# Altium schematic sheet top.SchDoc
size A4
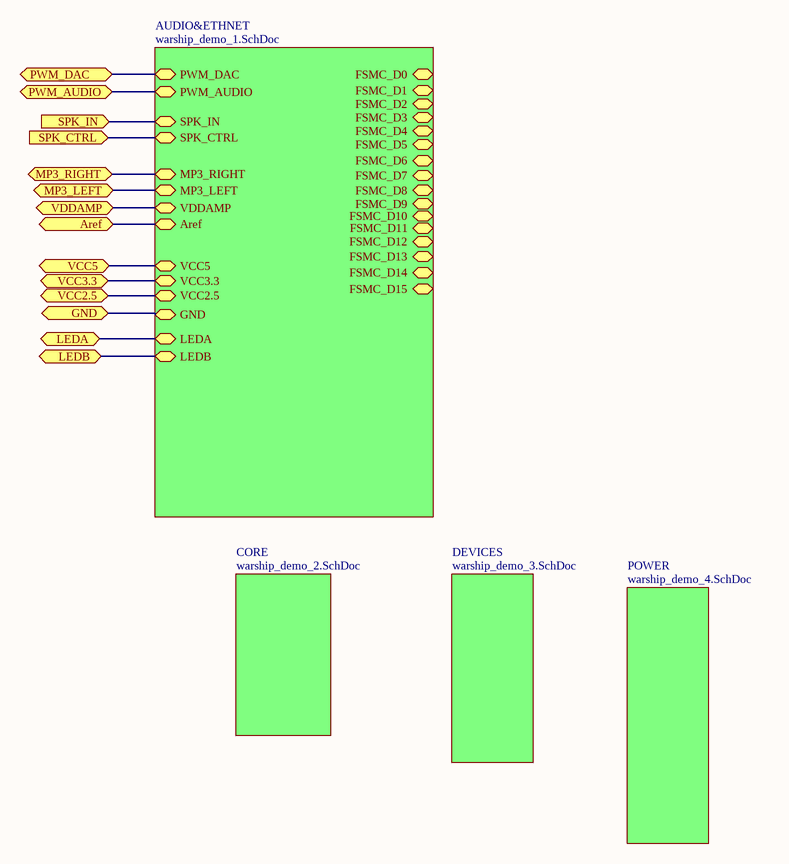
[diagram p0: top.SchDoc]

## Sub-sheets
AUDIO&ETHNET = warship_demo_1.SchDoc: PWM_DAC, PWM_AUDIO, SPK_IN, SPK_CTRL, MP3_RIGHT, MP3_LEFT, VDDAMP, Aref, VCC5, VCC3.3, VCC2.5, GND, LEDB, LEDA, FSMC_D0, FSMC_D1, FSMC_D2, FSMC_D3, FSMC_D4, FSMC_D5, FSMC_D6, FSMC_D7, FSMC_D8, FSMC_D9, FSMC_D10, FSMC_D11, FSMC_D12, FSMC_D13, FSMC_D14, FSMC_D15
CORE = warship_demo_2.SchDoc: no entries
DEVICES = warship_demo_3.SchDoc: no entries
POWER = warship_demo_4.SchDoc: no entries

## Ports
Aref, GND, LEDA, LEDB, MP3_LEFT, MP3_RIGHT, PWM_AUDIO, PWM_DAC, SPK_CTRL (in), SPK_IN (in), VCC2.5, VCC3.3, VCC5, VDDAMP

## Nets
Aref: port Aref, sheet AUDIO&ETHNET/Aref
GND: port GND, sheet AUDIO&ETHNET/GND
LEDA: port LEDA, sheet AUDIO&ETHNET/LEDA
LEDB: port LEDB, sheet AUDIO&ETHNET/LEDB
MP3_LEFT: port MP3_LEFT, sheet AUDIO&ETHNET/MP3_LEFT
MP3_RIGHT: port MP3_RIGHT, sheet AUDIO&ETHNET/MP3_RIGHT
PWM_AUDIO: port PWM_AUDIO, sheet AUDIO&ETHNET/PWM_AUDIO
PWM_DAC: port PWM_DAC, sheet AUDIO&ETHNET/PWM_DAC
SPK_CTRL: port SPK_CTRL, sheet AUDIO&ETHNET/SPK_CTRL
SPK_IN: port SPK_IN, sheet AUDIO&ETHNET/SPK_IN
VCC2.5: port VCC2.5, sheet AUDIO&ETHNET/VCC2.5
VCC3.3: port VCC3.3, sheet AUDIO&ETHNET/VCC3.3
VCC5: port VCC5, sheet AUDIO&ETHNET/VCC5
VDDAMP: port VDDAMP, sheet AUDIO&ETHNET/VDDAMP